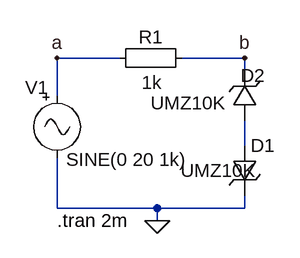
[diagram p0: schematic clipper_parallel_bipolar.asc]
clipper_parallel_bipolar.asc, the LTspice schematic file:
Version 4
SHEET 1 880 680
WIRE 32 80 -48 80
WIRE 192 80 112 80
WIRE 192 96 192 80
WIRE -48 128 -48 80
WIRE 192 192 192 160
WIRE -48 272 -48 208
WIRE 80 272 -48 272
WIRE 192 272 192 256
WIRE 192 272 80 272
WIRE 80 288 80 272
FLAG -48 80 a
FLAG 192 80 b
FLAG 80 288 0
SYMBOL Misc\\EuropeanResistor 128 64 R90
WINDOW 0 5 56 VBottom 2
WINDOW 3 32 55 VTop 2
SYMATTR InstName R1
SYMATTR Value 1k
SYMBOL Misc\\signal -48 112 R0
WINDOW 0 -41 6 Left 2
WINDOW 3 12 98 Left 2
WINDOW 123 0 0 Left 2
WINDOW 39 0 0 Left 2
SYMATTR InstName V1
SYMATTR Value SINE(0 20 1k)
SYMBOL zener 176 192 R0
WINDOW 3 -66 32 Left 2
SYMATTR Value UMZ10K
SYMATTR InstName D1
SYMBOL zener 208 160 R180
WINDOW 0 -10 57 Left 2
WINDOW 3 41 22 Left 2
SYMATTR InstName D2
SYMATTR Value UMZ10K
TEXT -48 288 Left 2 !.tran 2m

The netlist it stands for:
* clipper_parallel_bipolar.asc
R1 b a 1k
V1 a 0 SINE(0 20 1k)
D1 N001 0 UMZ10K
D2 N001 b UMZ10K
.model D D
.lib standard.dio
.tran 2m
.backanno
.end